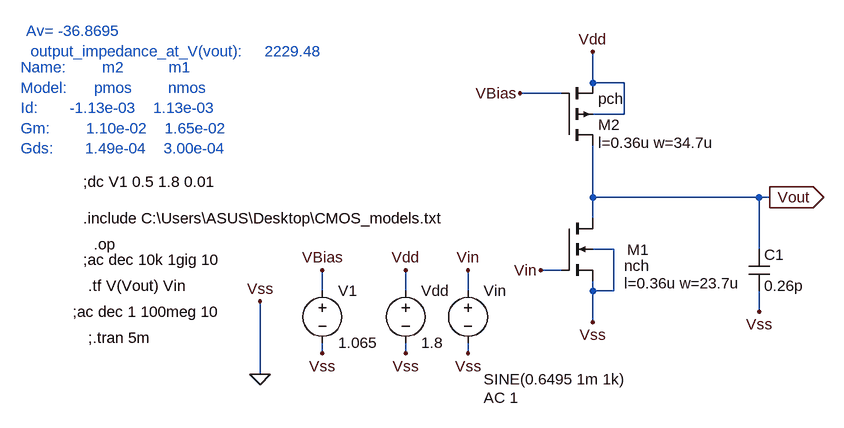
[diagram p0: schematic CS_amp_with_active_load.asc]
CS_amp_with_active_load.asc, the LTspice schematic file:
Version 4
SHEET 1 944 680
WIRE 432 -112 432 -160
WIRE 480 -112 432 -112
WIRE 384 -96 320 -96
WIRE 480 -64 480 -112
WIRE 480 -64 432 -64
WIRE 432 64 432 -16
WIRE 688 64 432 64
WIRE 704 64 688 64
WIRE 432 96 432 64
WIRE 464 144 432 144
WIRE 688 144 688 64
WIRE 384 176 352 176
WIRE 16 208 16 176
WIRE 144 208 144 176
WIRE 240 208 240 176
WIRE 432 208 432 192
WIRE 464 208 464 144
WIRE 464 208 432 208
WIRE 688 240 688 208
WIRE 432 256 432 208
WIRE 16 304 16 288
WIRE 144 304 144 288
WIRE 240 304 240 288
WIRE -80 336 -80 224
FLAG -80 336 0
FLAG -80 224 Vss
FLAG 240 176 Vin
FLAG 144 304 Vss
FLAG 240 304 Vss
FLAG 144 176 Vdd
FLAG 432 -160 Vdd
FLAG 352 176 Vin
FLAG 432 256 Vss
FLAG 704 64 Vout
IOPIN 704 64 Out
FLAG 688 240 Vss
FLAG 320 -96 VBias
FLAG 16 304 Vss
FLAG 16 176 VBias
DATAFLAG 432 64 ""
SYMBOL nmos4 384 96 R0
WINDOW 0 101 49 Left 2
WINDOW 3 96 73 Left 2
WINDOW 123 96 100 Left 2
SYMATTR InstName M1
SYMATTR Value nch
SYMATTR Value2 l=0.36u w=23.7u
SYMBOL voltage 144 192 R0
WINDOW 123 0 0 Left 0
WINDOW 39 0 0 Left 0
SYMATTR InstName Vdd
SYMATTR Value 1.8
SYMBOL voltage 240 192 R0
WINDOW 3 24 152 Left 2
WINDOW 123 24 180 Left 2
WINDOW 39 0 0 Left 0
SYMATTR Value SINE(0.6495 1m 1k)
SYMATTR Value2 AC 1
SYMATTR InstName Vin
SYMBOL cap 672 144 R0
SYMATTR InstName C1
SYMATTR Value 0.26p
SYMBOL pmos4 384 -16 M180
WINDOW 123 56 4 Left 2
SYMATTR Value2 l=0.36u w=34.7u
SYMATTR InstName M2
SYMATTR Value pch
SYMBOL voltage 16 192 R0
WINDOW 123 0 0 Left 0
WINDOW 39 0 0 Left 0
SYMATTR InstName V1
SYMATTR Value 1.065
TEXT -352 96 Left 2 !.include C:\\Users\\ASUS\\Desktop\\CMOS_models.txt
TEXT -336 136 Left 2 !.op
TEXT -352 160 Left 2 !;ac dec 10k 1gig 10
TEXT -344 200 Left 2 !.tf V(Vout) Vin
TEXT -368 240 Left 2 !;ac dec 1 100meg 10
TEXT -344 280 Left 2 !;.tran 5m
TEXT -352 40 Left 2 !;dc V1 0.5 1.8 0.01
TEXT -440 -192 Left 2 ;Av= -36.8695\n output_impedance_at_V(vout):     2229.48
TEXT -448 -136 Left 2 ;Name:        m2          m1\nModel:      pmos        nmos\nId:       -1.13e-03    1.13e-03\nGm:        1.10e-02    1.65e-02\nGds:       1.49e-04    3.00e-04

The netlist it stands for:
* CS_amp_with_active_load.asc
M1 Vout Vin 0 0 nch l=0.36u w=23.7u
Vdd Vdd 0 1.8
Vin Vin 0 SINE(0.6495 1m 1k) AC 1
C1 Vout 0 0.26p
M2 Vout VBias Vdd Vdd pch l=0.36u w=34.7u
V1 VBias 0 1.065
.model NMOS NMOS
.model PMOS PMOS
.lib standard.mos
.include C:\Users\ASUS\Desktop\CMOS_models.txt
.op
;ac dec 10k 1gig 10
.tf V(Vout) Vin
;ac dec 1 100meg 10
;.tran 5m
;dc V1 0.5 1.8 0.01
* Av= -36.8695
*  output_impedance_at_V(vout):     2229.48
* Name:        m2          m1
* Model:      pmos        nmos
* Id:       -1.13e-03    1.13e-03
* Gm:        1.10e-02    1.65e-02
* Gds:       1.49e-04    3.00e-04
.backanno
.end